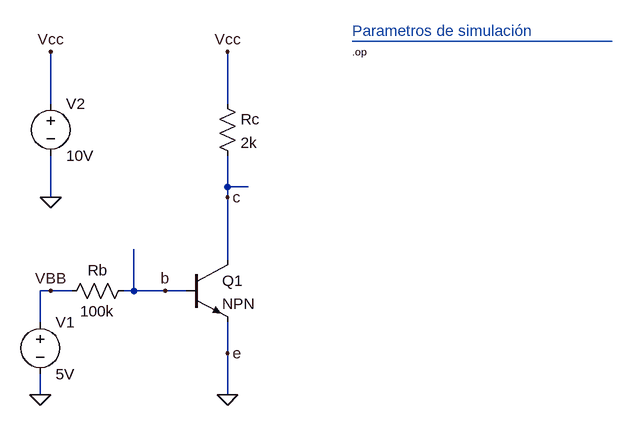
[diagram p0: schematic ejemplo_5-8.asc]
ejemplo_5-8.asc, the LTspice schematic file:
Version 4
SHEET 1 1376 680
WIRE -304 -240 -304 -320
WIRE -32 -240 -32 -320
WIRE -32 -112 -32 -160
WIRE 0 -112 -32 -112
WIRE -304 -96 -304 -160
WIRE -32 -96 -32 -112
WIRE -32 0 -32 -96
WIRE -304 48 -320 48
WIRE -272 48 -304 48
WIRE -176 48 -176 -16
WIRE -176 48 -192 48
WIRE -128 48 -176 48
WIRE -96 48 -128 48
WIRE -320 96 -320 48
WIRE -32 144 -32 96
WIRE -320 208 -320 176
WIRE -32 208 -32 144
FLAG -32 208 0
FLAG -304 -96 0
FLAG -32 -96 c
FLAG -32 144 e
FLAG -128 48 b
FLAG -304 -320 Vcc
FLAG -32 -320 Vcc
FLAG -320 208 0
FLAG -304 48 VBB
DATAFLAG -176 -16 ""
DATAFLAG 64 144 "Ie(Q1)"
DATAFLAG 0 -112 ""
DATAFLAG -144 112 "Ib(Q1)"
DATAFLAG 64 -48 "Ic(Q1)"
SYMBOL res -48 -256 R0
SYMATTR InstName Rc
SYMATTR Value 2k
SYMBOL npn -96 0 R0
SYMATTR InstName Q1
SYMBOL voltage -304 -256 R0
WINDOW 123 0 0 Left 0
WINDOW 39 0 0 Left 0
SYMATTR InstName V2
SYMATTR Value 10V
SYMBOL voltage -320 80 R0
WINDOW 123 0 0 Left 0
WINDOW 39 0 0 Left 0
SYMATTR InstName V1
SYMATTR Value 5V
SYMBOL res -176 32 R90
WINDOW 0 0 56 VBottom 2
WINDOW 3 32 56 VTop 2
SYMATTR InstName Rb
SYMATTR Value 100k
TEXT 160 -352 Left 2 ;Parametros de simulación
TEXT 160 -320 Left 1 !.op
LINE Normal 560 -336 160 -336
LINE Normal 560 -336 560 -336 2
LINE Normal 560 -336 560 -336 2

The netlist it stands for:
* ejemplo_5-8.asc
Rc Vcc c 2k
Q1 c b 0 0 NPN
V2 Vcc 0 10V
V1 VBB 0 5V
Rb b VBB 100k
.model NPN NPN
.model PNP PNP
.lib standard.bjt
* Parametros de simulación
.op
.backanno
.end